# Altium schematic sheet Schematicascii.SchDoc: STM32WB55CG USB Dongle Schematic
size A4; Author: Ph.A; SheetNumber: 2; SheetTotal: 2
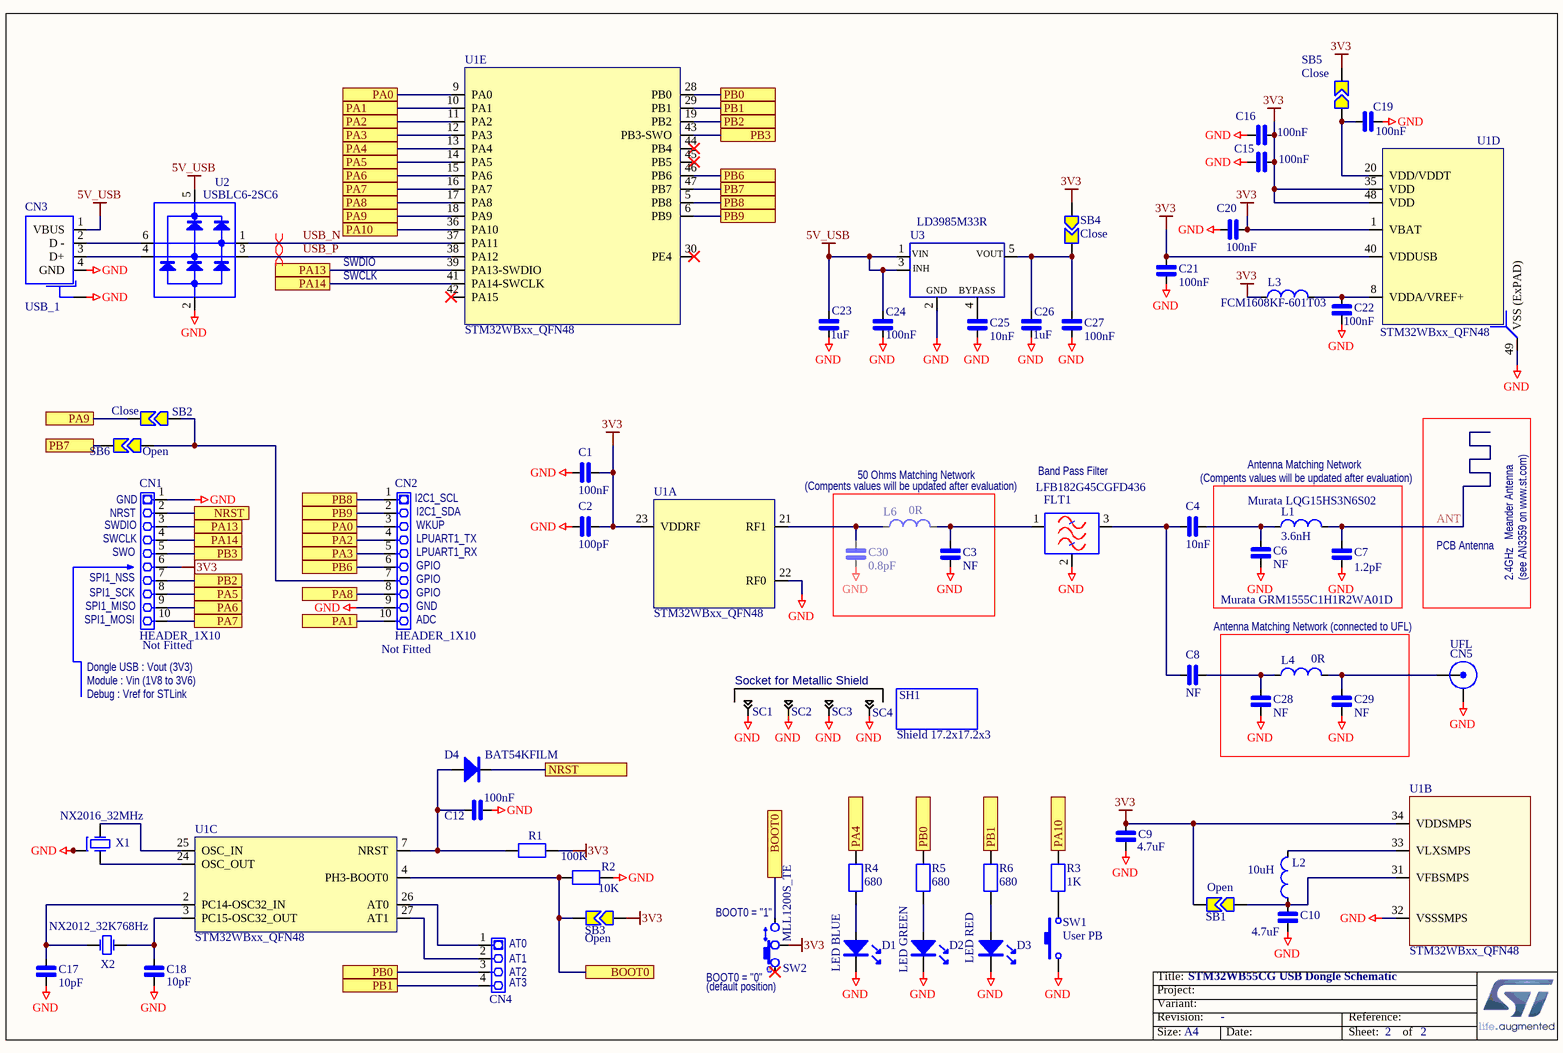
[diagram p0: Schematicascii.SchDoc]

## Parts
C1  100nF  [0402_CAP_NPOL]
C2  100pF  [0402_CAP_NPOL]
C3  NF  [0402_CAP_NPOL]
C4  10nF  [0402_CAP_NPOL]
C6  NF  [0402_CAP_NPOL]
C7  1.2pF  Ref: Murata GRM1555C1H1R2WA01D  [0402_CAP_NPOL]
C8  NF  [0402_CAP_NPOL]
C9  4.7uF  [0402_CAP_NPOL]
C10  4.7uF  [0402_CAP_NPOL]
C12  100nF  [0402_CAP_NPOL]
C15  100nF  [0402_CAP_NPOL]
C16  100nF  [0402_CAP_NPOL]
C17  10pF  [0402_CAP_NPOL]
C18  10pF  [0402_CAP_NPOL]
C19  100nF  [0402_CAP_NPOL]
C20  100nF  [0402_CAP_NPOL]
C21  100nF  [0402_CAP_NPOL]
C22  100nF  [0402_CAP_NPOL]
C23  1uF  [0603_CAP_NPOL]
C24  100nF  [0402_CAP_NPOL]
C25  10nF  [0402_CAP_NPOL]
C26  1uF  [0603_CAP_NPOL]
C27  100nF  [0402_CAP_NPOL]
C28  NF  [0402_CAP_NPOL]
C29  NF  [0402_CAP_NPOL]
C30  0.8pF  [0402_CAP_NPOL]
CN1  HEADER_1X10  Fitted: Not Fitted  [Header M/F 1x10x2.54 NF]
CN2  HEADER_1X10  Fitted: Not Fitted  [Header M/F 1x10x2.54 NF]
CN3  USB_1  [USB/A_M1]
CN4  HEADER_1X4  [SIL4_127_B]  (value not drawn)
CN5  UFL  [UFL]
D1  LED BLUE  [0603_LED_Blue]
D2  LED GREEN  [0603_LED_GREEN]
D3  LED RED  [0603_LED_RED]
D4  BAT54KFILM  [SOD523]
FLT1  LFB182G45CGFD436  [LFB182G45CGFD436]
L1  3.6nH  Ref: Murata LQG15HS3N6S02  [0402_COIL]
L2  10uH  [0805_COIL]
L3  FCM1608KF-601T03  [0603_COIL]
L4  0R  [0402_COIL]
L6  0R  [0402_COIL]
R1  100K  [0402_RES]
R2  10K  [0402_RES]
R3  1K  [0402_RES]
R4  680  [0402_RES]
R5  680  [0402_RES]
R6  680  [0402_RES]
SB1  Open  [SB-tiny]
SB2  Close  [SB-tiny]
SB3  Open  [SB-tiny]
SB4  Close  [SB-tiny]
SB5  Close  [SB-tiny]
SB6  Open  [SB-tiny]
SC1  Shield Clip_A 3.9x1.1x1.28  [Shield Clip_A 3.9x1.1x1.28]  (value not drawn)
SC2  Shield Clip_A 3.9x1.1x1.28  [Shield Clip_A 3.9x1.1x1.28]  (value not drawn)
SC3  Shield Clip_A 3.9x1.1x1.28  [Shield Clip_A 3.9x1.1x1.28]  (value not drawn)
SC4  Shield Clip_A 3.9x1.1x1.28  [Shield Clip_A 3.9x1.1x1.28]  (value not drawn)
SH1  Shield 17.2x17.2x3  [Shield 17.2x17.2x3]
SW1  User PB  [SW-PB SMD KMR2]
SW2  MLL1200S_TE  [MLL1200S_TE]
U1  STM32WBxx_QFN48  [STM32WBxx_QFN48]  (parts A,B,C,D,E of 5)
U2  USBLC6-2SC6  [SOT23-6]
U3  LD3985M33R  [SOT23-5]
X1  NX2016_32MHz  [NX2016_4P]
X2  NX2012_32K768Hz  [NX2012_2P]

## Blocks framed on the sheet
50 Ohms Matching Network: C3 C30 L6
Antenna Matching Network: C6 C7 L1

## Ports
BOOT0, NRST, PA0, PA1, PA2, PA3, PA4, PA5, PA6, PA7, PA8, PA9, PA10, PA13, PA14, PB0, PB1, PB2, PB3, PB6, PB7, PB8, PB9

## Nets
3V3: C1.2 C2.2 C9.1 C15.1 C16.1 C20.2 C21.2 CN1.6 L3.1 R1.1 SB1.2 SB3.1 SB4.1 SB5.2 SW2.2 U1.1(VBAT) U1.23(VDDRF) U1.34(VDDSMPS) U1.35(VDD) U1.40(VDDUSB) U1.48(VDD)
5V_USB: C23.2 C24.2 CN3.1(VBUS) U2.5 U3.1(VIN) U3.3(CE)
GND: C1.1 C2.1 C3.1 C6.2 C7.1 C9.2 C10.2 C12.2 C15.2 C16.2 C17.2 C18.2 C19.2 C20.1 C21.1 C22.2 C23.1 C24.1 C25.1 C26.1 C27.1 C28.2 C29.2 C30.1 CN1.1 CN2.9 CN3.0(Shield) CN3.4(GND) CN5.2(Y) D1.K D2.K D3.K FLT1.2(GND) R2.2 SC1.1 SC2.1 SC3.1 SC4.1 SW1.1 U1.22(RF0) U1.32(VSSSMPS) U1.49(VSS_(ExPAD)) U2.2 U3.2(VSS) X1.2 X1.4
ANT: C7.2 L1.2
BOOT0: R2.1 SB3.2 SW2.3 U1.4(PH3-BOOT0) ; port BOOT0
NRST: CN1.2 D4.K ; port NRST
PA0: CN2.3 U1.9(PA0) ; port PA0
PA1: CN2.10 U1.10(PA1) ; port PA1
PA2: CN2.4 U1.11(PA2) ; port PA2
PA3: CN2.5 U1.12(PA3) ; port PA3
PA4: R4.1 U1.13(PA4) ; port PA4
PA5: CN1.8 U1.14(PA5) ; port PA5
PA6: CN1.9 U1.15(PA6) ; port PA6
PA7: CN1.10 U1.16(PA7) ; port PA7
PA8: CN2.8 U1.17(PA8) ; port PA8
PA9: SB2.2 U1.18(PA9) ; port PA9
PA10: R3.2 U1.36(PA10) ; port PA10
PA13: CN1.3 U1.39(PA13-SWDIO) ; port PA13
PA14: CN1.4 U1.41(PA14-SWCLK) ; port PA14
PB0: CN4.3 R5.1 U1.28(PB0) ; port PB0
PB1: CN4.4 R6.1 U1.29(PB1) ; port PB1
PB2: CN1.7 U1.19(PB2) ; port PB2
PB3: CN1.5 U1.43(PB3-SWO) ; port PB3
PB6: CN2.6 U1.46(PB6) ; port PB6
PB7: SB6.2 U1.47(PB7) ; port PB7
PB8: CN2.1 U1.5(PB8) ; port PB8
PB9: CN2.2 U1.6(PB9) ; port PB9
USB_N: U1.37(PA11) U2.1
USB_P: U1.38(PA12) U2.3
NetC3_2: C3.2 FLT1.1(I/O) L6.2
NetC4_1: C4.1 C8.1 FLT1.3(I/O)
NetC4_2: C4.2 C6.1 L1.1
NetC8_2: C8.2 C28.1 L4.1
NetC10_1: C10.1 L2.1 SB1.1 U1.31(VFBSMPS)
NetC12_1: C12.1 D4.A R1.2 U1.7(NRST)
NetC17_1: C17.1 U1.2(PC14-OSC32_IN) X2.1(OSC1)
NetC18_1: C18.1 U1.3(PC15-OSC32_OUT) X2.2(OSC2)
NetC19_1: C19.1 SB5.1 U1.20(VDD/VDDT)
NetC22_1: C22.1 L3.2 U1.8(VDDA/VREF+)
NetC25_2: C25.2 U3.4(BYPASS)
NetC26_2: C26.2 C27.2 SB4.2 U3.5(VOUT)
NetC29_1: C29.1 CN5.1(X) L4.2
NetC30_2: C30.2 L6.1 U1.21(RF1)
NetCN2_7: CN2.7 SB2.1 SB6.1
NetCN3_2: CN3.2(D_-) U2.6
NetCN3_3: CN3.3(D+) U2.4
NetCN4_1: CN4.1 U1.26(AT0)
NetCN4_2: CN4.2 U1.27(AT1)
NetD1_A: D1.A R4.2
NetD2_A: D2.A R5.2
NetD3_A: D3.A R6.2
NetL2_2: L2.2 U1.33(VLXSMPS)
NetR3_1: R3.1 SW1.2
NetU1_24: U1.24(OSC_OUT) X1.3(OSC2)
NetU1_25: U1.25(OSC_IN) X1.1(OSC1)

Not connected (* = marked no-connect by the designer): SW2 1*; U1 30(PE4)* 42(PA15)* 44(PB4)* 45(PB5)*

## Layout directives
differential pair: USB_N, USB_P

## Notes on the sheet
- SWDIO
- SWCLK
- (near CN1) SWDIO
- (near CN1) NRST
- (near CN1) GND
- (near CN2) I2C1_SCL
- (near CN2) I2C1_SDA
- (near CN2) WKUP
- (Compents values will be updated after evaluation)
- Band Pass Filter
- (near CN1) SPI1_NSS
- (near CN1) SWCLK
- (near CN1) SWO
- (near CN2) LPUART1_TX
- (near CN2) LPUART1_RX
- (near CN2) GPIO
- PCB Antenna
- Meander Antenna
- 2.4GHz
- (see AN3359 on www.st.com)
- (near CN1) SPI1_MOSI
- (near CN1) SPI1_MISO
- (near CN1) SPI1_SCK
- (near CN2) ADC
- (near CN2) GND
- Antenna Matching Network (connected to UFL)
- (near CN1) Dongle USB : Vout (3V3)
- Module : Vin (1V8 to 3V6)
- Debug : Vref for STLink
- Socket for Metallic Shield
- (near SW2) BOOT0 = "1"
- (near CN4) AT0
- (near CN4) AT1
- (near CN4) AT2
- (near CN4) AT3
- (near SW2) BOOT0 = "0"
- (near SW2) (default position)
- Title:
- Project:
- Size:
- Revision:
- Variant:
- A4
- -
- Date:
- Reference:
- Sheet:
- of
- (in symbol LD3985M33R) INH; GND

## Library data of the parts
C1-C4 C6-C10 C12 C15-C30 = CAP_NPOL: Capacitor_not polarized
  C7: Fitted: Fitted
D1-D3 = LED: Light-Emitting Diode; Part Number A: *
D4 = BAT54K: Schottky Diode
FLT1 = LFB182G45CGFD436: Band Pass Filter Murata LFB182G45CGFD436
L1 L4 L6 = INDUCTOR_SMD_STDL
L2 = IND_74479777310A: Coil Wurtz 10uH ref: 74479777310A
L3 = IND_FCM1608KF-601T03
R1-R6 = RES: Resistor
SB1-SB6 = Strap2: Solder Jumper; Solder: YES; Published: 24-Mar-1999; Revision: July-2002: Re-released for DXP Platform.; Publisher: Altium Limited
SC1-SC4 = Shield Clip_A 3.9x1.1x1.28: Harwin S0951-46R
SH1 = Shield
SW1 = SW-PB_1: Push-button SMD; Order code RS: 102-412
U2 = USBLC6-2
U3 = LD3985M33R: 3.3V low drop voltage regulator; Manufacturer: STMicroelectronics; Isortie max: 550mA; V entrée max: 6V; Manufacturer P/N: LD3985M33R; Order code Farnell: *; V sortie Typ. V: 3.3V; Temperature Max: +125°C; Type: Fixed; Temperature Min: -40°C
X1 = NX2016_32M: Crystal NDK 2.0x1.6mm  32 MHz; Manufacturer P/N: NX2016SA 32 MHz EXS00A-CS06654; Manufacturer: NDK
X2 = NX2012_32K768: Crystal NDK 2.0x1.2mm  32.768 KHz; Manufacturer P/N: NX2012SA 32.768KHz  EXS00A-MU00389; Manufacturer: NDK